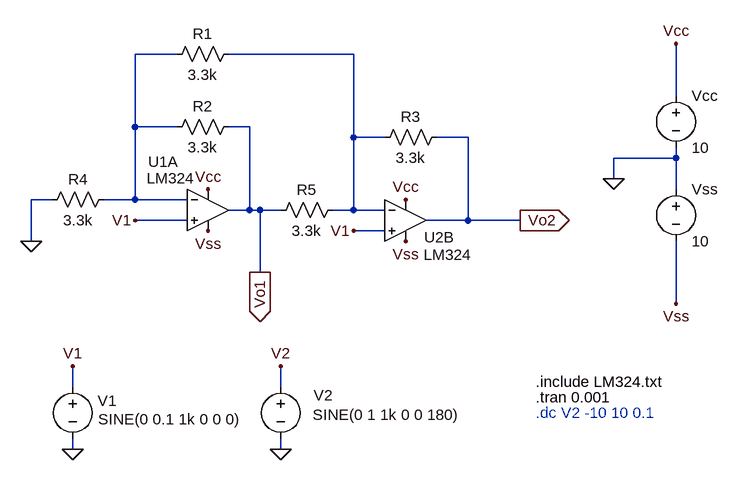
[diagram p0: schematic lab1-1.asc]
lab1-1.asc, the LTspice schematic file:
Version 4.1
SHEET 1 1120 680
WIRE 80 -80 16 -80
WIRE 352 -80 160 -80
WIRE 848 -16 848 -96
WIRE 16 32 16 -80
WIRE 80 32 16 32
WIRE 192 32 160 32
WIRE 352 48 352 -80
WIRE 400 48 352 48
WIRE 528 48 480 48
WIRE 848 80 848 64
WIRE 848 80 752 80
WIRE 752 112 752 80
WIRE 848 128 848 80
WIRE -112 144 -144 144
WIRE 16 144 16 32
WIRE 16 144 -32 144
WIRE 96 144 16 144
WIRE 192 160 192 32
WIRE 192 160 160 160
WIRE 208 160 192 160
WIRE 240 160 208 160
WIRE 352 160 352 48
WIRE 352 160 320 160
WIRE 400 160 352 160
WIRE 96 176 16 176
WIRE 528 176 528 48
WIRE 528 176 464 176
WIRE 608 176 528 176
WIRE 400 192 352 192
WIRE -144 208 -144 144
WIRE 208 256 208 160
WIRE 848 304 848 208
WIRE -80 432 -80 400
WIRE 240 432 240 400
WIRE -80 528 -80 512
WIRE 240 528 240 512
FLAG -144 208 0
FLAG 752 112 0
FLAG 208 256 Vo1
IOPIN 208 256 Out
FLAG 608 176 Vo2
IOPIN 608 176 Out
FLAG -80 400 V1
FLAG 240 400 V2
FLAG -80 528 0
FLAG 240 528 0
FLAG 848 -96 Vcc
FLAG 128 128 Vcc
FLAG 432 144 Vcc
FLAG 128 192 Vss
FLAG 432 208 Vss
FLAG 848 304 Vss
FLAG 352 192 V1
FLAG 16 176 V1
SYMBOL res -16 128 R90
WINDOW 0 0 56 VBottom 2
WINDOW 3 32 56 VTop 2
SYMATTR InstName R4
SYMATTR Value 3.3k
SYMBOL res 176 16 R90
WINDOW 0 0 56 VBottom 2
WINDOW 3 32 56 VTop 2
SYMATTR InstName R2
SYMATTR Value 3.3k
SYMBOL res 176 -96 R90
WINDOW 0 0 56 VBottom 2
WINDOW 3 32 56 VTop 2
SYMATTR InstName R1
SYMATTR Value 3.3k
SYMBOL res 336 144 R90
WINDOW 0 0 56 VBottom 2
WINDOW 3 32 56 VTop 2
SYMATTR InstName R5
SYMATTR Value 3.3k
SYMBOL res 496 32 R90
WINDOW 0 0 56 VBottom 2
WINDOW 3 32 56 VTop 2
SYMATTR InstName R3
SYMATTR Value 3.3k
SYMBOL voltage 848 -32 R0
WINDOW 123 0 0 Left 0
WINDOW 39 0 0 Left 0
SYMATTR InstName Vcc
SYMATTR Value 10
SYMBOL voltage 848 112 R0
WINDOW 123 0 0 Left 0
WINDOW 39 0 0 Left 0
SYMATTR InstName Vss
SYMATTR Value 10
SYMBOL voltage -80 416 R0
WINDOW 123 0 0 Left 0
WINDOW 39 0 0 Left 0
WINDOW 0 38 37 Left 2
WINDOW 3 39 66 Left 2
SYMATTR InstName V1
SYMATTR Value SINE(0 0.1 1k 0 0 0)
SYMBOL voltage 240 416 R0
WINDOW 123 0 0 Left 0
WINDOW 39 0 0 Left 0
WINDOW 3 49 59 Left 2
WINDOW 0 51 29 Left 2
SYMATTR Value SINE(0 1 1k 0 0 180)
SYMATTR InstName V2
SYMBOL OpAmps\\opamp2 128 96 R0
WINDOW 0 -92 -10 Left 2
WINDOW 3 -94 15 Left 2
SYMATTR InstName U1A
SYMATTR Value LM324
SYMBOL OpAmps\\opamp2 432 112 R0
WINDOW 0 29 90 Left 2
WINDOW 3 28 117 Left 2
SYMATTR InstName U2B
SYMATTR Value LM324
TEXT 632 448 Left 2 !.tran 0.001
TEXT 632 424 Left 2 !.include LM324.txt
TEXT 632 472 Left 2 ;.dc V2 -10 10 0.1

The netlist it stands for:
* lab1-1.asc
R4 N001 0 3.3k
R2 Vo1 N001 3.3k
R1 N002 N001 3.3k
R5 N002 Vo1 3.3k
R3 Vo2 N002 3.3k
Vcc Vcc 0 10
Vss 0 Vss 10
V1 V1 0 SINE(0 0.1 1k 0 0 0)
V2 V2 0 SINE(0 1 1k 0 0 180)
X§U1A V1 N001 Vcc Vss Vo1 LM324  ; pins In+ In- V+ V- OUT
X§U2B V1 N002 Vcc Vss Vo2 LM324  ; pins In+ In- V+ V- OUT
.tran 0.001
.include LM324.txt
* .dc V2 -10 10 0.1
.backanno
.end